# EasyEDA Pro project New Project.eprj

# Schematic Schematic1
Create Date: 2022-03-31; Project Name: New Project; Schematic Name: Schematic1; Update Date: 2022-03-31
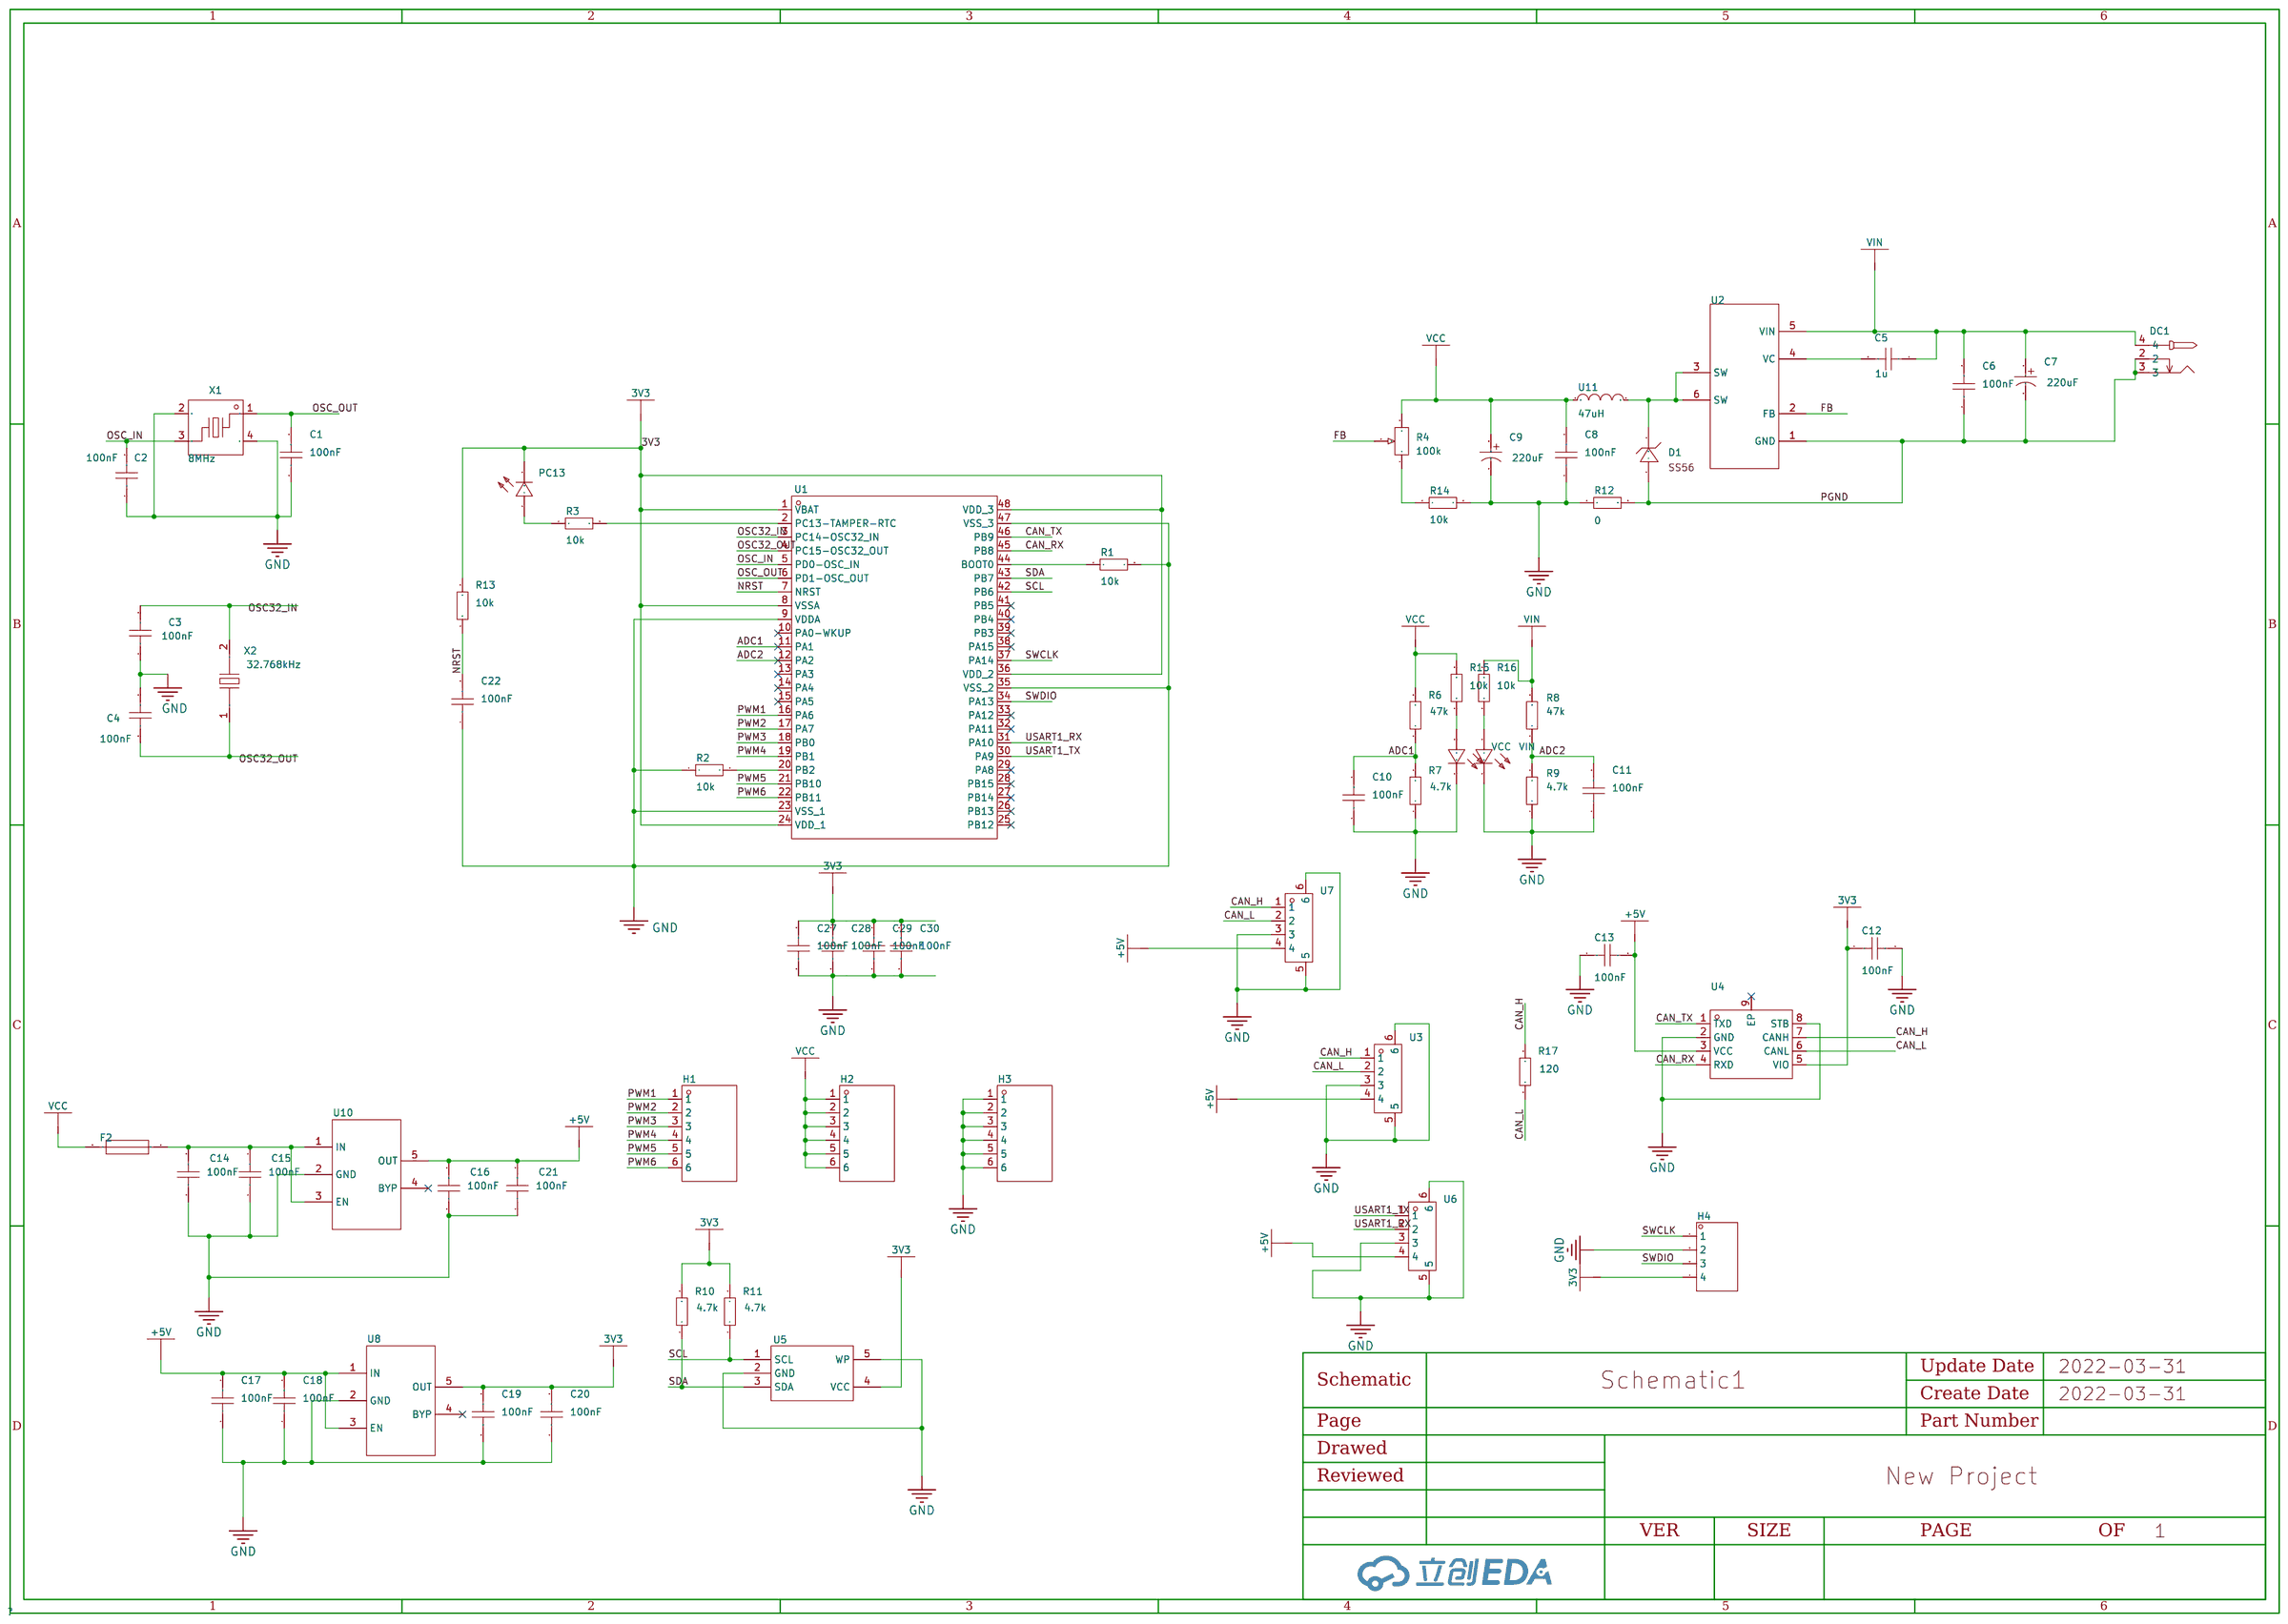
[diagram p0: schematic sheet]

## Parts
C1  100nF  [C0603]
C2  100nF  [C0603]
C3  100nF  [C0603]
C4  100nF  [C0603]
C5  1u  [C0603]
C6  100nF  [C0603]
C7  220uF  [CAP-SMD_BD6.3-L6.6-W6.6-FD-1]
C8  100nF  [C0603]
C9  220uF  [CAP-SMD_BD6.3-L6.6-W6.6-FD-1]
C10  100nF  [C0603]
C11  100nF  [C0603]
C12  100nF  [C0603]
C13  100nF  [C0603]
C14  100nF  [C0603]
C15  100nF  [C0603]
C16  100nF  [C0603]
C17  100nF  [C0603]
C18  100nF  [C0603]
C19  100nF  [C0603]
C20  100nF  [C0603]
C21  100nF  [C0603]
C22  100nF  [C0603]
C27  100nF  [C0603]
C28  100nF  [C0603]
C29  100nF  [C0603]
C30  100nF  [C0603]
D1  -  [SMA_L4.4-W2.6-LS5.0-RD]
DC1  -  [DC-IN-TH_DC-5520-1]
F2  -  [F1206]
H1  -  [HDR-TH_6P-P2.54-V_Z-211-0611-0021-001]
H2  -  [HDR-TH_6P-P2.54-V_Z-211-0611-0021-001]
H3  -  [HDR-TH_6P-P2.54-V_Z-211-0611-0021-001]
H4  -  [HDR-TH_4P-P2.54-V-M]
PC13  -  [LED0603-R-RD]
R1  10k  [R0603_1]
R2  10k  [R0603_1]
R3  10k  [R0603_1]
R4  100k  [RES-ADJ-TH_3P-L9.5-W4.9-P2.50-L_3296W]
R6  47k  [R0603_1]
R7  4.7k  [R0603_1]
R8  47k  [R0603_1]
R9  4.7k  [R0603_1]
R10  4.7k  [R0603]
R11  4.7k  [R0603]
R12  0  [R1206]
R13  10k  [R0603]
R14  10k  [R0603]
R15  10k  [R0603]
R16  10k  [R0603]
R17  120  [R0603]
U1  -  [LQFP-48_L7.0-W7.0-P0.50-LS9.0-BL]
U2  -  [TO-263-5_L10.2-W8.9-P1.70-TL]
U3  -  [CONN-SMD_4P-P2.50_XH2.50-4AB_1]
U4  -  [HVSON-8_L3.0-W3.0-P0.65-BL-EP]
U5  -  [SOT-23-5_L3.0-W1.7-P0.95-LS2.8-BR_1]
U6  -  [CONN-SMD_4P-P2.50_XH2.50-4AB_1]
U7  -  [CONN-SMD_4P-P2.50_XH2.50-4AB_1]
U8  -  [SOT-23-5_L3.0-W1.7-P0.95-LS2.8-TL]
U10  -  [SOT-23-5_L3.0-W1.7-P0.95-LS2.8-BR]
U11  47uH  [IND-TH_L12.5-W6.5-P8.00-D0.5]
VCC  -  [LED0603-R-RD]
VIN  -  [LED0603-R-RD]
X1  8MHz  [CRYSTAL-SMD_4P-L3.2-W2.5-BL]
X2  32.768kHz  [OSC-SMD_2P-L3.2-W1.5-1]

## Library data of the parts
C1-C6 C8 C10-C22 C27-C30 = CC0603KRX7R9BB104: 容值:100nF;精度:±10%;额定电压:50V;温度系数:X7R;; LCSC Part Name: 100nF ±10% 50V; Supplier Part: C14663; Manufacturer: YAGEO(国巨); Supplier Footprint: 0603; JLCPCB Part Class: Basic Part; Datasheet: https://atta.szlcsc.com/upload/public/pdf/source/20170116/1484561234239.pdf; Supplier: LCSC; Tolerance: ±10%; Voltage Rated: 50V; Temperature Coefficient: X7R
C7 C9 = 50SEV10M6.3X5.5: 容值:10uF;精度:±20%;额定电压:50V;电容体直径:6.3mm;电容体长度:5.5mm;纹波电流:-;等效串联电阻:-;工作寿命:2000hrs@85;工作温度:-40~+85;; LCSC Part Name: 10uF ±20% 50V; Supplier Part: C88809; Manufacturer: rubycon(红宝石); Supplier Footprint: SMD,6.3x5.5mm; JLCPCB Part Class: Extended Part; Datasheet: https://atta.szlcsc.com/upload/public/pdf/source/20161125/1480067898590.pdf; Supplier: LCSC; Tolerance: ±20%; Rated Voltage: 50V; φD: 6.3mm; L: 5.5mm; Lifetime @ Temp: 2000hrs@85; Operating Temperature: -40~+85
D1 = SS56_C379835: 直流反向耐压（Vr）:60V;平均整流电流（Io）:5A;正向压降（Vf）:550mV @ 5A;; LCSC Part Name: SS56; Supplier Part: C379835; Manufacturer Part: SS56; Supplier Footprint: SMA; JLCPCB Part Class: Extended Part; Datasheet: https://atta.szlcsc.com/upload/public/pdf/source/20190403/C379835_A6104CE7F1A63165C53675BFBA3A1721.pdf; Supplier: LCSC
DC1 = DC-005 2.0: 连接器类型:DC电源插座;安装方式:弯插;触点内径:2mm;触点外径:6.4mm;额定电流:-;额定电压:-;工作温度范围:-;; LCSC Part Name: DC电源插座 内径:2mm 外径:6.4mm 铁材质; Supplier Part: C16214; Manufacturer: BOOMELE(博穆精密); Supplier Footprint: 插件; JLCPCB Part Class: Extended Part; Datasheet: https://atta.szlcsc.com/upload/public/pdf/source/20190827/C16214_DA59F99E888FED58D9833F5341D610B0.pdf; Supplier: LCSC; Connector Type: DC电源插座; Mounting Style: 弯插; Inside Contact Diameter: 2mm; Outside Contact Diameter: 6.4mm
F2 = JK-nSMD050-30: 最大电压:30V;最大电流:100A;保持电流:500mA;跳闸电流:1A;消耗功率:600mW;初始态阻值(最小值):150m;跳断后阻值(最大值):300m;最大动作时间:100ms;工作温度:-40~+85;; LCSC Part Name: 0.5A 30V 1206 自恢复保险丝 PTC; Supplier Part: C720075; Manufacturer: JK(金科); Supplier Footprint: 1206; JLCPCB Part Class: Extended Part; Datasheet: https://atta.szlcsc.com/upload/public/pdf/source/20200810/C720075_06AF2D4541537091880CC35F0EFB49F8.pdf; Supplier: LCSC; Operating Voltage (Max): 30V; Current Rating (Max): 100A; Hold Current: 500mA; Trip Current: 1A; Power Dissipation: 600mW; Resistance - Initial (Ri) (Min): 150m; Resistance - Post Trip (R1) (Max): 300m; Maximum Time to Trip: 100ms; Operating Temperature: -40~+85
H1-H3 = Z-211-0611-0021-001: 间距:2.54mm;总PIN位数:6;排数:1;插针结构:-;行距:-;安装类型:直插;圆针/方针:-;额定电流:-;额定电压:-;配合针长度:-;塑高:-;触头材质:黄铜;触头镀层:-;颜色:黑色;; LCSC Part Name: 2.54mm; Supplier Part: C190819; Manufacturer: Nextron(台湾正凌); Supplier Footprint: 插件,P=2.54mm; JLCPCB Part Class: Extended Part; Datasheet: https://atta.szlcsc.com/upload/public/pdf/source/20180731/C190819_A681B1380B379CDFC378560BE13D8C8F.pdf; Supplier: LCSC; Pitch: 2.54mm; Number of Pins: 6; Number of Rows: 1; Mounting Type: 直插; Contact Material: 黄铜; Color: 黑色
H4 = B-2100S04P-A110: 间距:2.54mm;总PIN位数:4;排数:1;插针结构:1x4P;行距:-;安装类型:直插;圆针/方针:-;额定电流:-;额定电压:-;配合针长度:6mm;塑高:2.54mm;端接针长度:3mm;触头材质:黄铜;触头镀层:-;工作温度范围:-40~+105;颜色:黑色;; LCSC Part Name: 2.54mm 1x4P; Supplier Part: C124378; Manufacturer: Ckmtw(灿科盟); Supplier Footprint: 插件,P=2.54mm; JLCPCB Part Class: Extended Part; Datasheet: https://atta.szlcsc.com/upload/public/pdf/source/20170821/C124378_1503303307508901532.pdf; Supplier: LCSC; Pitch: 2.54mm; Number of Pins: 4; Number of Rows: 1; Pin Structure: 1x4P; Mounting Type: 直插; Length of Mating Pin: 6mm; Insulation Height: 2.54mm; Length of End Connection Pin: 3mm; Contact Material: 黄铜; Operating Temperature Range: -40~+105; Color: 黑色
PC13 VCC VIN = 19-217/GHC-YR1S2/3T: 发光颜色:翠绿;二极管配置:-;透镜颜色:无色透明;主波长:520nm~535nm;峰值波长:518nm;色温:-;光通量(25时):-;测试电流:20mA;正向电压(VF):3.3V;发光强度:285mcd;功率:110mW;发光角度:120°;安装方式:-;工作温度:-40~+85;; LCSC Part Name: 翠绿LED; Supplier Part: C72043; Manufacturer: EVERLIGHT(台湾亿光); Supplier Footprint: 0603; JLCPCB Part Class: Basic Part; Datasheet: https://atta.szlcsc.com/upload/public/pdf/source/20160507/1462613613780.pdf; Supplier: LCSC; Emitted Color: 翠绿; Lens Color: 无色透明; Dominant Wavelength: 520nm~535nm; Peak Wavelength: 518nm; Forward Current: 20mA; Forward Voltage (VF): 3.3V; Luminous Intensity: 285mcd; Power Dissipation: 110mW; Viewing Angle: 120°; Operating Temperature: -40~+85
R1-R3 R6-R9 = RC-01W1002FT: 阻值:10k;精度:±1%;功率:50mW;温度系数:±200ppm/;最大工作电压:25V;工作温度范围:-55~+125;; LCSC Part Name: 10k ±1%; Supplier Part: C304501; Manufacturer: FH(风华); Supplier Footprint: 0201; JLCPCB Part Class: Extended Part; Datasheet: https://atta.szlcsc.com/upload/public/pdf/source/20181030/C304501_FF38550671994E5E8FB5233A4E4A9820.pdf; Supplier: LCSC; Tolerance: ±1%; Power(Watts): 50mW; Temperature Coefficient: ±200ppm/; Overload Voltage (Max): 25V; Operating Temperature Range: -55~+125
R4 = 3296W-1-104: 阻值:100k;精度:±10%;温度系数:±250ppm/;; LCSC Part Name: 100k ±10%; Supplier Part: C118963; Manufacturer: BOCHEN(博晨); Supplier Footprint: 插件; JLCPCB Part Class: Extended Part; Datasheet: https://atta.szlcsc.com/upload/public/pdf/source/20171114/C118963_15106326662041117450.pdf; Supplier: LCSC; Tolerance: ±10%; Temperature Coefficient: ±250ppm/
R10 R11 R13-R17 = TR0603B10K0P0525Z: 电阻类型:薄膜电阻;阻值:10k;精度:±0.1%;功率:100mW;温度系数:±25ppm/;最大工作电压:75V;工作温度范围:-55~+155;; LCSC Part Name: 10k ±0.1% 100mW; Supplier Part: C188363; Manufacturer: EVER OHMS(天二科技); Supplier Footprint: 0603; JLCPCB Part Class: Extended Part; Datasheet: https://atta.szlcsc.com/upload/public/pdf/source/20190415/C188363_433BF05B6FB8F7A0F5F35A3E4390C55A.pdf; Supplier: LCSC; Type: 薄膜电阻; Tolerance: ±0.1%; Power(Watts): 100mW; Temperature Coefficient: ±25ppm/; Overload Voltage (Max): 75V; Operating Temperature Range: -55~+155
R12 = AC1206FR-7W10KL: 电阻类型:厚膜电阻;阻值:10k;精度:±1%;功率:500mW;温度系数:±100ppm/;最大工作电压:200V;工作温度范围:-55~+155;; LCSC Part Name: 10k ±1% 500mW; Supplier Part: C326700; Manufacturer: YAGEO(国巨); Supplier Footprint: 1206; JLCPCB Part Class: Extended Part; Datasheet: https://atta.szlcsc.com/upload/public/pdf/source/20181101/C326700_C96334D0F3D32995F8E743E70BB73329.pdf; Supplier: LCSC; Type: 厚膜电阻; Tolerance: ±1%; Power(Watts): 500mW; Temperature Coefficient: ±100ppm/; Overload Voltage (Max): 200V; Operating Temperature Range: -55~+155
U1 = STM32F103C8T6: 主频（MAX):72MHz;工作电压:2V ~ 3.6V;; Supplier Part: C8734; Manufacturer: ST(意法半导体); Supplier Footprint: LQFP-48_7x7x05P; JLCPCB Part Class: Basic Part; Datasheet: https://atta.szlcsc.com/upload/public/pdf/source/20140724/1457707174202.pdf; Supplier: LCSC; Speed: 72MHz; Voltage - Supply (Vcc/Vdd): 2V ~ 3.6V; Program Memory Size: 64KB; RAM Size: 20KB; Number of I/O: 37; A/D: 10x12bit; PWM: 13; UART/USART: 3 USART; I2C（SMBUS/PMBUS）: 2; USB Device: 1; CAN: 1
U2 = XL4015E1: 功能类型:降压型;同步整流:-;输出通道数:-;拓扑结构:-;输入电压:-;输出电流(最大值):-;开关频率:-;; LCSC Part Name: 降压型; Supplier Part: C51661; Manufacturer: XLSEMI(芯龙); Supplier Footprint: TO-263-5; JLCPCB Part Class: Extended Part; Datasheet: https://atta.szlcsc.com/upload/public/pdf/source/20150618/1457707323461.pdf; Supplier: LCSC; Function: 降压型
U3 U6 U7 = XH2.5-4P-LS_1: LCSC Part Name: XH2.5-4P-LS; Supplier Part: C9900001834; Manufacturer Part: XH2.5-4P-LS; Supplier Footprint: SMD_XH2.5-4P-LS; JLCPCB Part Class: Extended Part; Datasheet: 2021-11-13/272192A/916e3be17c0c414ab50f4328a8cee917/254立贴承认书.pdf; Supplier: LCSC
U4 = SIT1042TK/3: 类型:-;协议类别:-;驱动器/接收器数:-;数据速率:-;; LCSC Part Name: CAN收发器芯片; Supplier Part: C1121845; Manufacturer: SIT(芯力特); Supplier Footprint: HVSON-8; JLCPCB Part Class: Extended Part; Datasheet: https://atta.szlcsc.com/upload/public/pdf/source/20201217/C1121843_88798D5AA5E17D4FE8882F968B4CCD4F.pdf; Supplier: LCSC
U5 = K24C02_1: 存储器容量:2Kb (256 x 8);存储器接口类型:I2C;工作电压:1.8V ~ 5.5V;; LCSC Part Name: K24C02; Supplier Part: C84964; Manufacturer: 华虹宏力; Manufacturer Part: K24C02; Supplier Footprint: SOT-23-5; JLCPCB Part Class: Extended Part; Datasheet: https://atta.szlcsc.com/upload/public/pdf/source/20161024/1477288693549.pdf; Supplier: LCSC; Memory Format: EEPROM; Memory Size: 2Kb (256 x 8); Memory Interface: I2C; Voltage - Supply: 1.8V ~ 5.5V
U8 = SPX3819M5-L-5-0/TR: 输出类型:固定;输出极性:正;输出通道数:1;最大输入电压:16V;输出电压:5V;压差:700mV@(500mA);输出电流:500mA;电源纹波抑制比(PRSS):-;; LCSC Part Name: Vin=16V Vout=5V 500mA; Supplier Part: C13417; Manufacturer: MaxLinear; Supplier Footprint: SOT-23-5; JLCPCB Part Class: Extended Part; Datasheet: https://atta.szlcsc.com/upload/public/pdf/source/20150720/1457707331934.pdf; Supplier: LCSC; Output Type: 固定; Output Polarity: 正; Number of Outputs: 1; Maximum Input Voltage: 16V; Output Voltage: 5V; Dropout Voltage: 700mV@(500mA); Output Current: 500mA
U10 = SPX3819M5-L-3-3/TR: 输出类型:固定;输出极性:正;输出通道数:1;最大输入电压:16V;输出电压:3.3V;压差:700mV@(500mA);输出电流:500mA;电源纹波抑制比(PRSS):70dB;; LCSC Part Name: Vin=16V Vout=3.3V 500mA 70dB; Supplier Part: C9055; Manufacturer: MaxLinear; Supplier Footprint: SOT-23-5; JLCPCB Part Class: Extended Part; Datasheet: https://atta.szlcsc.com/upload/public/pdf/source/20160421/1461205045150.pdf; Supplier: LCSC; Output Type: 固定; Output Polarity: 正; Number of Outputs: 1; Maximum Input Voltage: 16V; Output Voltage: 3.3V; Dropout Voltage: 700mV@(500mA); Output Current: 500mA; Power Supply Rejection Ratio (PRSS): 70dB
U11 = SLT040125T470MUB: 类型:磁环电感;电感值:47uH;精度:±20%;额定电流:2A;饱和电流(Isat):-;直流电阻(DCR):42m;Q值:-;自谐频率:-;车规等级:-;脚间距:-;; LCSC Part Name: 47uH ±20% 2A 42m; Supplier Part: C326002; Manufacturer: Sunltech(韩国顺磁); Supplier Footprint: 插件; JLCPCB Part Class: Extended Part; Datasheet: https://atta.szlcsc.com/upload/public/pdf/source/20181123/C326002_261DE052296031ED64330EFF6DF1C136.pdf; Supplier: LCSC; Type: 磁环电感; Tolerance: ±20%; Rated Current: 2A; DC Resistance: 42m
X1 = X32258MSB4SI: 晶振类型:贴片无源晶振;频率:8MHz;频率公差:±10ppm;频率稳定度:±30ppm;负载电容:20pF;工作温度:-40~+85;; LCSC Part Name: 8MHz ±10ppm 20pF; Supplier Part: C2682774; Manufacturer: YXC扬兴科技; Supplier Footprint: SMD3225-4P; JLCPCB Part Class: Extended Part; Datasheet: https://atta.szlcsc.com/upload/public/pdf/source/20210106/C2682774_0CD4FDA5D9DA3FBEEC23BD607A48E4B0.pdf; Supplier: LCSC; Crystal Type: 贴片无源晶振; Frequency Tolerance: ±10ppm; Frequency Stability: ±30ppm; Load Capacitance: 20pF; Operating Temperature: -40~+85
X2 = G3100327072070CY: 晶振类型:贴片无源晶振;频率:32.768kHz;频率公差:±20ppm;频率稳定度:-;负载电容:7pF;等效串联电阻(ESR):70k;工作温度:-40~+85;; LCSC Part Name: 32.768kHz ±20ppm 7pF; Supplier Part: C909615; Manufacturer: JGHC(晶光华); Supplier Footprint: SMD3215-2P; JLCPCB Part Class: Extended Part; Datasheet: https://atta.szlcsc.com/upload/public/pdf/source/20201023/C909615_5CB83FDF197FE73AFEAD0F20FB1E7116.pdf; Supplier: LCSC; Crystal Type: 贴片无源晶振; Frequency Tolerance: ±20ppm; Load Capacitance: 7pF; Equivalent Series Resistance (ESR): 70k; Operating Temperature: -40~+85

## Nets
3V3: C12.1 C19.2 C20.2 C27.2 C28.2 C29.2 C30.2 H4.4 PC13.2(C) R10.2 R11.2 R13.2 U1.1(VBAT) U1.8(VSSA) U1.24(VDD_1) U1.36(VDD_2) U1.48(VDD_3) U4.5(VIO) U5.4(VCC) U8.5(OUT)
+5V: C13.2 C16.2 C17.2 C18.2 C21.2 U3.4 U4.3(VCC) U6.4 U7.4 U8.1(IN) U8.3(EN) U10.5(OUT)
GND: C1.1 C2.1 C3.1 C4.1 C8.1 C9.2 C10.1 C11.1 C12.2 C13.1 C14.1 C15.1 C16.1 C17.1 C18.1 C19.1 C20.1 C21.1 C22.1 C27.1 C28.1 C29.1 C30.1 H3.1 H3.2 H3.3 H3.4 H3.5 H3.6 H4.2 R1.2 R2.1 R7.1 R9.1 R12.1 R14.2 U1.9(VDDA) U1.23(VSS_1) U1.35(VSS_2) U1.47(VSS_3) U3.3 U3.5 U3.6 U4.2(GND) U4.8(STB) U5.2(GND) U5.5(WP) U6.3 U6.5 U6.6 U7.3 U7.5 U7.6 U8.2(GND) U10.2(GND) VCC.2(C) VIN.2(C) X1.2(GND) X1.4(GND)
PGND: C6.1 C7.2 D1.2(A) DC1.2 DC1.3 R12.2 U2.1(GND)
VCC: C8.2 C9.1 F2.1 H2.1 H2.2 H2.3 H2.4 H2.5 H2.6 R4.3 R6.2 R15.2 U11.1
VIN: C5.1 C6.2 C7.1 DC1.4 R8.2 R16.2 U2.5(VIN)
ADC1: C10.2 R6.1 R7.2 U1.11(PA1)
ADC2: C11.2 R8.1 R9.2 U1.12(PA2)
CAN_H: R17.2 U3.1 U4.7(CANH) U7.1
CAN_L: R17.1 U3.2 U4.6(CANL) U7.2
CAN_RX: U1.45(PB8) U4.4(RXD)
CAN_TX: U1.46(PB9) U4.1(TXD)
FB: R4.2 U2.2(FB)
NRST: C22.2 R13.1 U1.7(NRST)
OSC32_IN: C3.2 U1.3(PC14-OSC32_IN) X2.2
OSC32_OUT: C4.2 U1.4(PC15-OSC32_OUT) X2.1
OSC_IN: C2.2 U1.5(PD0-OSC_IN) X1.3
OSC_OUT: C1.2 U1.6(PD1-OSC_OUT) X1.1
PWM1: H1.1 U1.16(PA6)
PWM2: H1.2 U1.17(PA7)
PWM3: H1.3 U1.18(PB0)
PWM4: H1.4 U1.19(PB1)
PWM5: H1.5 U1.21(PB10)
PWM6: H1.6 U1.22(PB11)
SCL: R11.1 U1.42(PB6) U5.1(SCL)
SDA: R10.1 U1.43(PB7) U5.3(SDA)
SWCLK: H4.1 U1.37(PA14)
SWDIO: H4.3 U1.34(PA13)
USART1_RX: U1.31(PA10) U6.2
USART1_TX: U1.30(PA9) U6.1
$1N3592: R1.1 U1.44(BOOT0)
$1N3832: R2.2 U1.20(PB2)
$1N4516: R3.2 U1.2(PC13-TAMPER-RTC)
$1N4646: PC13.1(A) R3.1
$1N6342: D1.1(C) U2.3(SW) U2.6(SW) U11.2
$1N8410: R4.1 R14.1
$1N9123: C5.2 U2.4(VC)
$1N37223: C14.2 C15.2 F2.2 U10.1(IN) U10.3(EN)
$1N44323: R15.1 VCC.1(A)
$1N44406: R16.1 VIN.1(A)

Not connected (* = marked no-connect by the designer): U1 10(PA0-WKUP)* 13(PA3)* 14(PA4)* 15(PA5)* 25(PB12)* 26(PB13)* 27(PB14)* 28(PB15)* 29(PA8)* 32(PA11)* 33(PA12)* 38(PA15)* 39(PB3)* 40(PB4)* 41(PB5)*; U4 9(EP)*; U8 4(BYP)*; U10 4(BYP)*

# Board PCB1
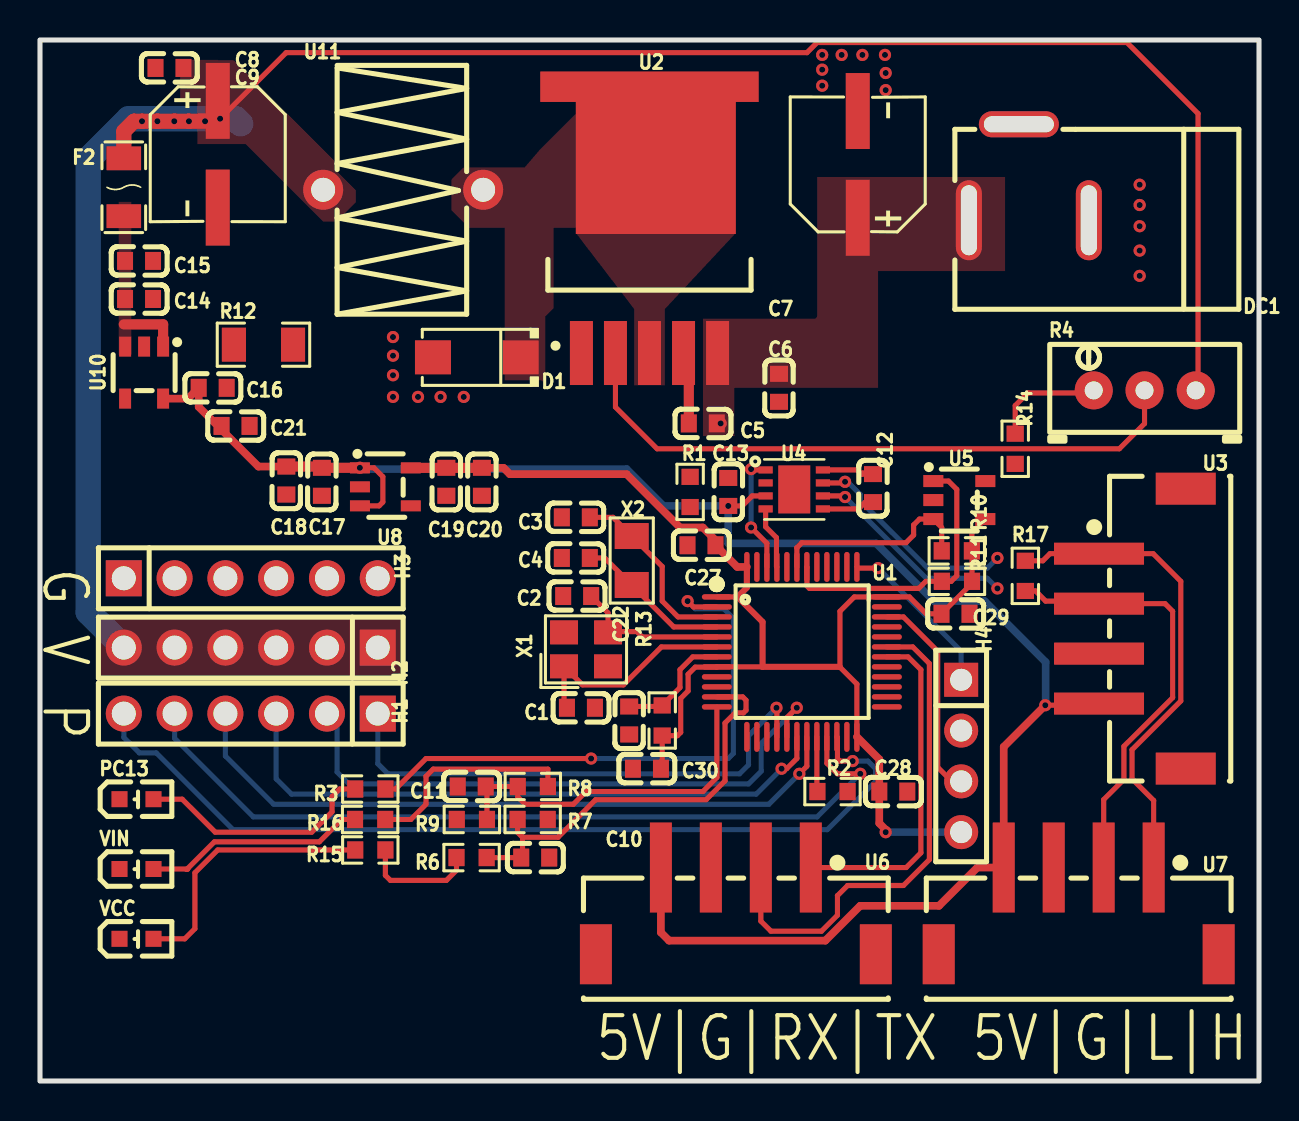
[diagram p1: board, top side]
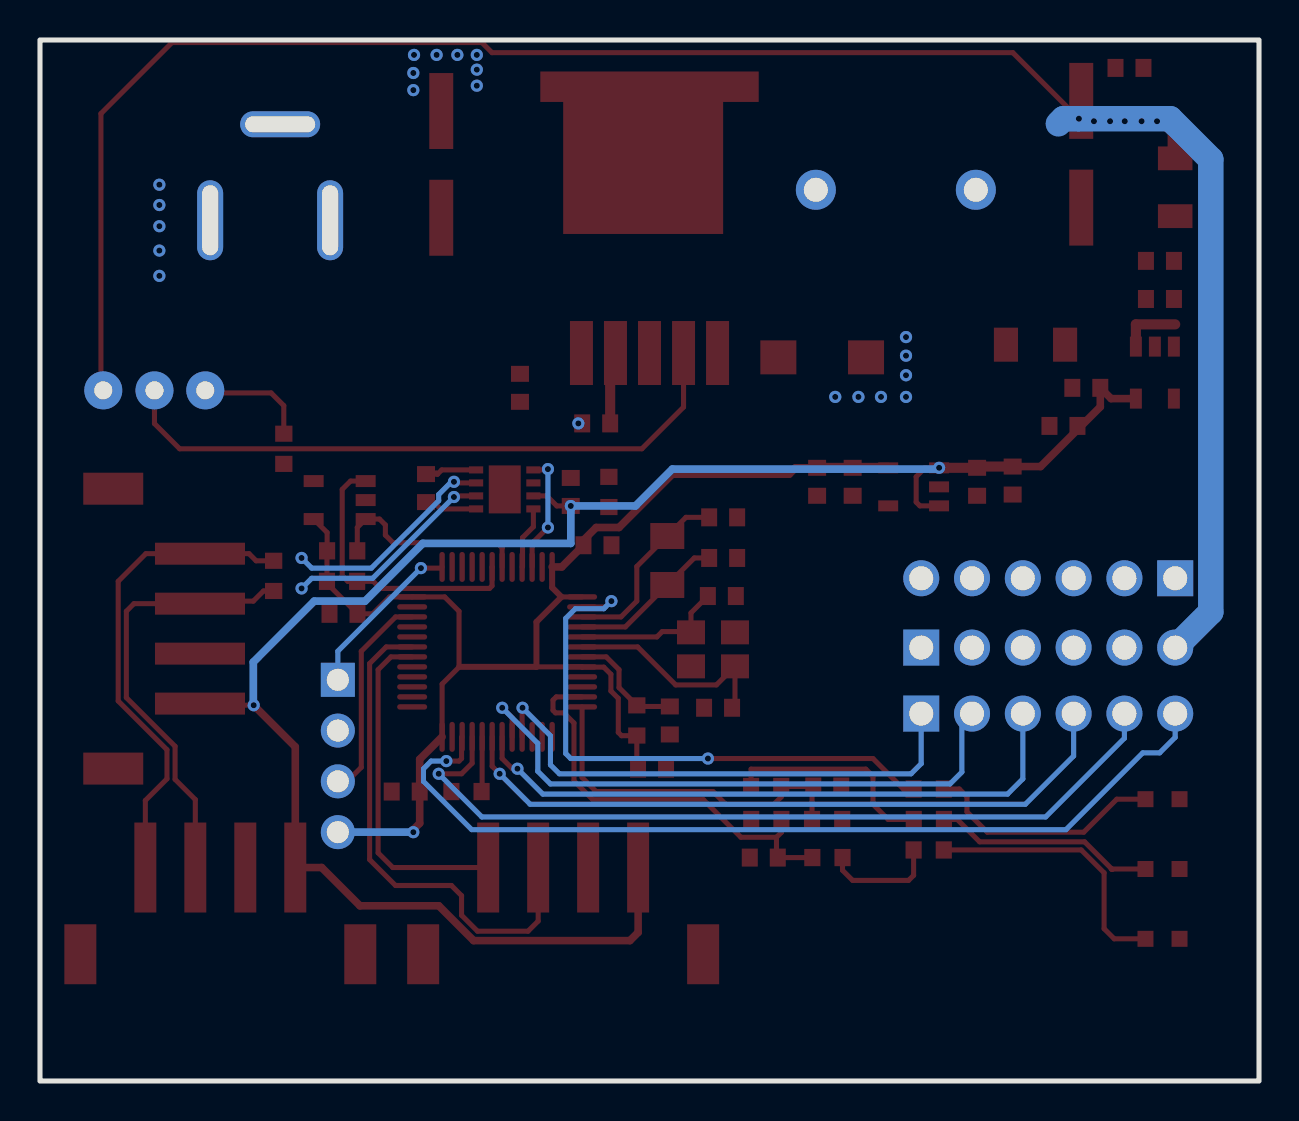
[diagram p2: board, bottom side, seen from below]

Outline 60.96 x 52.07 mm; copper layers: Top Layer, Bottom Layer. Coordinates in mm from the lower left corner of the outline.
Outline path: rectangle 0,52.07 60.96,0
Stack: Top Layer 0.035mm / 介电1 1.51mm FR4 er 4.5 / Bottom Layer 0.035mm

## Design rules (mm)
spacing safeClearance (default): track to track 0.152, other pairs 0.152 to 0.3
track width trackWidth (default): min 0.127, default 0.254, max 2.54
track width 5V: min 0.381, default 0.508, max 2.54
differential pair differentialPair (default): width min 0.127, default 0.254, max 2.54; gap min 0.152, default 0.152
via viaSize (default): diameter min 0.5, default 0.61, max 10; hole min 0.3, default 0.305, max 6

## Placement (name value [footprint] x y rotation side)
C1  100nF  [C0603]  27.05 18.67 180 top
C2  100nF  [C0603]  26.86 24.26 0 top
C3  100nF  [C0603]  26.8 28.19 0 top
C4  100nF  [C0603]  26.8 26.16 0 top
C5  1u  [C0603]  33.15 32.89 180 top
C6  100nF  [C0603]  36.96 34.67 90 top
C7  220uF  [CAP-SMD_BD6.3-L6.6-W6.6-FD-1]  40.89 45.85 90 top
C8  100nF  [C0603]  6.48 50.67 0 top
C9  220uF  [CAP-SMD_BD6.3-L6.6-W6.6-FD-1]  8.89 46.35 270 top
C10  100nF  [C0603]  24.76 11.18 180 top
C11  100nF  [C0603]  21.59 14.73 0 top
C12  100nF  [C0603]  41.66 29.66 90 top
C13  100nF  [C0603]  34.42 29.46 270 top
C14  100nF  [C0603]  4.95 39.12 180 top
C15  100nF  [C0603]  4.95 41.02 180 top
C16  100nF  [C0603]  8.64 34.67 180 top
C17  100nF  [C0603]  14.1 29.97 90 top
C18  100nF  [C0603]  12.32 30.03 90 top
C19  100nF  [C0603]  20.32 29.97 90 top
C20  100nF  [C0603]  22.1 29.97 90 top
C21  100nF  [C0603]  9.78 32.77 180 top
C22  100nF  [C0603]  29.46 18.03 90 top
C27  100nF  [C0603]  33.08 26.8 0 top
C28  100nF  [C0603]  42.67 14.48 180 top
C29  100nF  [C0603]  45.78 23.37 180 top
C30  100nF  [C0603]  30.35 15.62 0 top
D1  -  [SMA_L4.4-W2.6-LS5.0-RD]  21.84 36.19 180 top
DC1  -  [DC-IN-TH_DC-5520-1]  49.45 45.45 180 top
F2  -  [F1206]  4.19 44.7 270 top
H1  -  [HDR-TH_6P-P2.54-V_Z-211-0611-0021-001]  10.54 18.38 180 top
H2  -  [HDR-TH_6P-P2.54-V_Z-211-0611-0021-001]  10.54 21.68 180 top
H3  -  [HDR-TH_6P-P2.54-V_Z-211-0611-0021-001]  10.54 25.15 0 top
H4  -  [HDR-TH_4P-P2.54-V-M]  46.07 16.26 270 top
PC13  -  [LED0603-R-RD]  4.83 14.1 0 top
R1  10k  [R0603_1]  32.51 29.46 90 top
R2  10k  [R0603_1]  39.63 14.48 180 top
R3  10k  [R0603_1]  16.52 14.6 0 top
R4  100k  [RES-ADJ-TH_3P-L9.5-W4.9-P2.50-L_3296W]  55.25 34.54 0 top
R6  47k  [R0603_1]  21.58 11.18 180 top
R7  4.7k  [R0603_1]  24.64 13.08 180 top
R8  47k  [R0603_1]  24.65 14.73 0 top
R9  4.7k  [R0603_1]  21.6 13.08 0 top
R10  4.7k  [R0603]  45.85 26.52 0 top
R11  4.7k  [R0603]  45.85 24.99 0 top
R12  0  [R1206]  11.18 36.83 0 top
R13  10k  [R0603]  31.11 18.03 270 top
R14  10k  [R0603]  48.77 31.62 270 top
R15  10k  [R0603]  16.52 11.56 0 top
R16  10k  [R0603]  16.51 13.08 0 top
R17  120  [R0603]  49.28 25.27 90 top
U1  -  [LQFP-48_L7.0-W7.0-P0.50-LS9.0-BL]  38.1 21.46 270 top
U2  -  [TO-263-5_L10.2-W8.9-P1.70-TL]  30.48 41.42 90 top
U3  -  [CONN-SMD_4P-P2.50_XH2.50-4AB_1]  55.13 22.63 270 top
U4  -  [HVSON-8_L3.0-W3.0-P0.65-BL-EP]  37.72 29.59 270 top
U5  -  [SOT-23-5_L3.0-W1.7-P0.95-LS2.8-BR_1]  45.97 29.06 180 top
U6  -  [CONN-SMD_4P-P2.50_XH2.50-4AB_1]  34.8 8.51 180 top
U7  -  [CONN-SMD_4P-P2.50_XH2.50-4AB_1]  51.94 8.51 180 top
U8  -  [SOT-23-5_L3.0-W1.7-P0.95-LS2.8-TL]  17.27 29.72 0 top
U10  -  [SOT-23-5_L3.0-W1.7-P0.95-LS2.8-BR]  5.21 35.43 90 top
U11  47uH  [IND-TH_L12.5-W6.5-P8.00-D0.5]  18.16 44.58 0 top
VCC  -  [LED0603-R-RD]  4.83 7.11 0 top
VIN  -  [LED0603-R-RD]  4.83 10.6 0 top
X1  8MHz  [CRYSTAL-SMD_4P-L3.2-W2.5-BL]  27.31 21.59 0 top
X2  32.768kHz  [OSC-SMD_2P-L3.2-W1.5-1]  29.59 26.03 90 top

## Footprints (pads in the part's own frame, mm; a bottom-side part is the same pattern mirrored in y, then rotated)
C0603
  rect 0.8x0.9 smd: 1(-0.7,0) 2(0.7,0)
CAP-SMD_BD6.3-L6.6-W6.6-FD-1
  rect 3.8x1.199 smd: 1(-2.67,0) 2(2.67,0)
CONN-SMD_4P-P2.50_XH2.50-4AB_1
  rect 1.1x4.501 smd: 1(-3.749,-2.169) 2(-1.25,-2.169) 3(1.25,-2.169) 4(3.749,-2.169)
  rect 1.6x2.999 smd: 5(-7,2.169) 6(7,2.169)
CRYSTAL-SMD_4P-L3.2-W2.5-BL
  rect 1.4x1.2 smd: 1(-1.1,-0.85) 2(1.1,-0.85) 3(1.1,0.85) 4(-1.1,0.85)
DC-IN-TH_DC-5520-1
  oval 4x1.3 hole 3.5x0.8: 2(0.5,-2.401)
  oval 1.3x4 hole 0.8x3.5: 3(-2.999,2.401) 4(2.999,2.401)
F1206
  rect 1.192x1.727 smd: 1(-1.446,0) 2(1.446,0)
HDR-TH_4P-P2.54-V-M
  rect 1.7x1.7 hole 1.1: 1(-3.81,0)
  round 1.7 hole 1.1: 2(-1.27,0) 3(1.27,0) 4(3.81,0)
HDR-TH_6P-P2.54-V_Z-211-0611-0021-001
  rect 1.801x1.801 hole 1.199: 1(-6.35,0)
  round 1.801 hole 1.199: 2(-3.81,0) 3(-1.27,0) 4(1.27,0) 5(3.81,0) 6(6.35,0)
HVSON-8_L3.0-W3.0-P0.65-BL-EP
  rect 0.355x0.711 smd: 1(-0.976,-1.433) 2(-0.325,-1.433) 3(0.325,-1.433) 4(0.976,-1.433) 5(0.976,1.433) 6(0.325,1.433) 7(-0.325,1.433) 8(-0.976,1.433)
  rect 2.401x1.6 smd: 9(0,0)
IND-TH_L12.5-W6.5-P8.00-D0.5
  round 1.999 hole 1.199: 1(-4,0) 2(4,0)
LED0603-R-RD
  rect 0.8x0.8 smd: 1(0.851,0) 2(-0.851,0)
LQFP-48_L7.0-W7.0-P0.50-LS9.0-BL
  oval 0.269x1.501 smd: 1(-2.751,-4.25) 2(-2.251,-4.25) 3(-1.75,-4.25) 4(-1.25,-4.25) 5(-0.75,-4.25) 6(-0.249,-4.25) 7(0.249,-4.25) 8(0.75,-4.25) 9(1.25,-4.25) 10(1.75,-4.25) 11(2.251,-4.25) 12(2.751,-4.25) 25(2.751,4.25) 26(2.251,4.25) 27(1.75,4.25) 28(1.25,4.25) 29(0.75,4.25) 30(0.249,4.25) 31(-0.249,4.25) 32(-0.75,4.25) 33(-1.25,4.25) 34(-1.75,4.25) 35(-2.251,4.25) 36(-2.751,4.25)
  oval 1.501x0.269 smd: 13(4.25,-2.751) 14(4.25,-2.251) 15(4.25,-1.75) 16(4.25,-1.25) 17(4.25,-0.75) 18(4.25,-0.249) 19(4.25,0.249) 20(4.25,0.75) 21(4.25,1.25) 22(4.25,1.75) 23(4.25,2.251) 24(4.25,2.751) 37(-4.25,2.751) 38(-4.25,2.251) 39(-4.25,1.75) 40(-4.25,1.25) 41(-4.25,0.75) 42(-4.25,0.249) 43(-4.25,-0.249) 44(-4.25,-0.75) 45(-4.25,-1.25) 46(-4.25,-1.75) 47(-4.25,-2.251) 48(-4.25,-2.751)
OSC-SMD_2P-L3.2-W1.5-1
  rect 1.3x1.7 smd: 1(-1.224,0) 2(1.224,0)
R0603
  rect 0.807x0.864 smd: 1(-0.754,0) 2(0.754,0)
R0603_1
  rect 0.807x0.864 smd: 1(-0.754,0) 2(0.754,0)
R1206
  rect 1.206x1.702 smd: 1(-1.478,0) 2(1.478,0)
RES-ADJ-TH_3P-L9.5-W4.9-P2.50-L_3296W
  round 1.9 hole 0.899: 1(-2.55,0) 2(-0.01,0) 3(2.55,0)
SMA_L4.4-W2.6-LS5.0-RD
  rect 1.801x1.7 smd: 1(-2.192,0) 2(2.192,0)
SOT-23-5_L3.0-W1.7-P0.95-LS2.8-BR
  rect 1.001x0.6 smd: 1(1.3,-0.95) 2(1.3,0) 3(1.3,0.95) 4(-1.3,0.95) 5(-1.3,-0.95)
SOT-23-5_L3.0-W1.7-P0.95-LS2.8-BR_1
  rect 1.001x0.6 smd: 1(1.3,-0.95) 2(1.3,0) 3(1.3,0.95) 4(-1.3,0.95) 5(-1.3,-0.95)
SOT-23-5_L3.0-W1.7-P0.95-LS2.8-TL
  rect 1x0.55 smd: 1(-1.272,0.95) 2(-1.272,0) 3(-1.272,-0.95) 4(1.272,-0.95) 5(1.272,0.95)
TO-263-5_L10.2-W8.9-P1.70-TL
  rect 3.2x1.151 smd: 1(-5.009,3.404) 2(-5.009,1.702) 3(-5.009,0) 4(-5.009,-1.702) 5(-5.009,-3.404)
  custom 8.128x10.922 smd: 6(5.009,-0.318)

## Nets
As in the schematic.

Pads without a net: U1 10 13 14 15 25 26 27 28 29 32 33 38 39 40 41; U4 9; U8 4; U10 4

## Via types
v1: diameter 0.61, hole 0.305, Top Layer to Bottom Layer, 46 vias

## Routing (per net, layer and track width the routed paths; a pad name or vN(x,y) marks a point on that pad's centre or on a via; arc(x,y) is an arc through that point)
3V3: length 69.1
  Top Layer w0.254: 46.61,24.89 R11.2 ; 46.61,24.89 46.61,26.51 R10.2 46.6,27.43 U5.4 ; 46.61,24.89 C29.2 44.32,23.37 43.48,24.21 U1.36 40.72,24.21 40,23.49 40,20.73 39.99,20.71 40.85,19.85 U1.24 ; U1.1 34.88,24.21 ; U4.5 40.93,28.62 41.28,28.96 C12.1 ; 36.13,20.71 U1.8 33.84,20.7 32.77,20.7 32.41,20.35 32.41,19.51 32.04,19.14 32.04,17.44 31.88,17.27 31.12,17.27 R13.2 31.11,15.68 C30.2
  Top Layer w0.3: 39.99,20.71 36.13,20.71 36.13,22.96 34.88,24.21 35.35,24.68 U1.48
  Top Layer w0.381: 22.1,30.67 23.18,30.67 23.5,30.35 29.34,30.35 32,27.69 33.15,27.69 33.78,27.05 C27.2 34.87,25.71 U1.48 ; U1.24 41.97,16.09 C28.2 41.97,12.89 42.29,12.57 v1(42.29,12.45)
  Top Layer w0.508: U8.5 22.09,30.67 22.1,30.67
  Bottom Layer w0.381: v1(42.29,12.45) 42.29,12.45 H4.4
+5V: length 93.5
  Top Layer w0.254: v1(50.27,18.8) 52.88,18.8 U3.4 ; U8.1 16.7,30.67 17.14,30.23 17.14,28.96 16.96,28.77 U8.3 ; v1(34.42,28.76) 35.11,28.76 35.62,29.27 U4.3
  Top Layer w0.381: U10.5 7.4,34.13 C16.2 7.94,33.72 10.92,30.73 C18.2 ; v1(50.27,18.8) 48.19,16.72 U7.4 46.87,10.68 44.96,8.76 41.02,8.76 39.28,7.02 31.46,7.02 31.05,7.43 U6.4
  Top Layer w0.508: C18.2 14.03,30.73 14.1,30.67 v1(16,30.67) U8.1
  Bottom Layer w0.381: 50.29,18.8 50.29,20.95 47.24,24 44.7,24 41.82,26.89 34.42,26.89 v1(34.42,28.76) 31.18,28.76 29.34,30.61 16,30.61
GND: length 2.7
  Top Layer w0.254: 41.08,30.35 40.87,30.57 U4.8 ; 41.08,30.35 41.65,30.35 C12.2 ; 41.08,30.35 41.15,30.42
PGND:
  vias: v1(17.65,37.21) v1(17.65,36.28) v1(17.65,35.3) v1(17.65,34.22) v1(18.9,34.22) v1(20.03,34.22) v1(21.19,34.22) v1(39.12,51.32) v1(39.12,50.59) v1(39.12,49.78) v1(40.09,51.32) v1(41.13,51.32) v1(42.26,51.32) v1(42.29,50.42) v1(42.29,49.56) v1(54.99,44.83) v1(54.99,43.81) v1(54.99,42.76) v1(54.99,41.54) v1(54.99,40.27)
VCC: length 111
  Top Layer w0.254: 20.83,11.18 20.83,10.54 20.32,10.03 17.53,10.03 17.27,10.29 R15.2 ; R4.3 57.91,34.66 57.91,48.39 54.36,51.94 38.86,51.94 38.35,51.43 12.31,51.43 v1(9.01,48.13)
  Top Layer w0.762: v1(8.25,48.01) v1(7.45,48.01) v1(6.71,48.01) v1(5.87,48.01) v1(5.1,48.01) 4.7,48.01 4.19,47.5 F2.1
  Bottom Layer w1.27: 10.03,47.88 9.78,48.13 v1(9.01,48.13) 4.44,48.13 2.41,46.1 2.41,23.46 H2.6
VIN: length 10.9
  Top Layer w0.254: R8.2 25.4,15.6 19.66,15.6 19.3,15.24 19.3,13.84 18.54,13.08 R16.2
  vias: v1(34.04,32.89)
ADC1: length 21.3
  Top Layer w0.254: 24.13,12.19 24.13,11.24 C10.2 R6.1 ; 24.13,12.19 23.88,12.45 23.88,12.45 R7.2 ; 24.13,12.19 25.91,12.19 27.79,14.07 33.32,14.07 34.26,15.01 34.26,17.91 34.76,18.41 35.18,18.41 35.31,18.54 35.31,19.05 35.14,19.21 U1.11
ADC2: length 18
  Top Layer w0.254: R9.2 22.35,14.67 C11.2 R8.1 23.89,14.21 24.26,13.84 26.67,13.84 27.31,14.48 33.15,14.48 33.85,15.18 U1.12
CAN_H: length 35.2
  Top Layer w0.254: 55.69,10.68 55.69,14.03 54.61,15.11 54.61,16.57 57.05,19.01 57.05,24.99 55.67,26.38 U3.1 50.51,26.38 50.15,26.02 R17.2 ; 39.15,29.92 40.2,29.92 v1(40.26,29.97)
  Bottom Layer w0.254: v1(40.26,29.97) 40.39,29.97 41.02,29.34 41.02,29.02 44.39,25.65 47.37,25.65 v1(47.88,26.16)
CAN_L: length 32.7
  Top Layer w0.254: U7.2 53.19,14.08 54.2,15.09 54.2,16.74 56.64,19.18 56.64,23.49 56.26,23.88 U3.2 52.83,24 50.29,24 49.78,24.51 R17.1 ; v1(40.26,29.21) 40.2,29.27 U4.6
  Bottom Layer w0.254: v1(40.26,29.21) 44.32,25.15 47.37,25.15 v1(47.88,24.64)
CAN_RX: length 3.1
  Top Layer w0.254: U1.45 36.83,25.73 36.83,27.18 36.29,27.72 U4.4
CAN_TX: length 6
  Top Layer w0.254: U4.1 35.6,30.57 v1(35.56,30.61) ; v1(35.56,27.69) 36.35,26.9 U1.46
  Bottom Layer w0.254: v1(35.56,30.61) v1(35.56,27.69)
FB: length 32.2
  Top Layer w0.254: R4.2 55.23,32.88 53.97,31.62 30.86,31.62 28.78,33.71 U2.2
NRST: length 5.9
  Top Layer w0.254: U1.7 32.64,21.21 32,20.57 32,19.68 R13.1 31.06,18.73 C22.2
OSC32_IN: length 9.4
  Top Layer w0.254: C3.2 28.66,28.19 X2.2 31.11,25.74 31.11,24 31.91,23.21 U1.3
OSC32_OUT: length 7.8
  Top Layer w0.254: U1.4 31.69,22.71 X2.1 28.24,26.16 C4.2
OSC_IN: length 7.7
  Top Layer w0.254: U1.5 30.11,22.21 29.84,22.48 28.44,22.48 X1.3 28.41,23.41 C2.2
OSC_OUT: length 10.9
  Top Layer w0.254: U1.6 31.07,21.71 29.17,19.81 27.13,19.81 X1.1 26.2,18.81 C1.2
PWM1: length 26.3
  Top Layer w0.254: v1(36.83,18.67) 36.85,18.65 U1.16
  Bottom Layer w0.254: v1(36.83,18.67) 35.43,17.27 35.43,15.81 34.99,15.37 17.4,15.37 16.89,15.87 H1.1
PWM2: length 30.4
  Top Layer w0.254: U1.17 37.35,18.17 v1(37.85,18.67)
  Bottom Layer w0.254: v1(37.85,18.67) 36.07,16.89 36.07,15.49 35.43,14.86 15.45,14.86 14.86,15.45 14.86,17.87 H1.2
PWM3: length 31.4
  Top Layer w0.254: v1(37.08,15.62) 37.34,15.62 37.85,16.13 U1.18
  Bottom Layer w0.254: H1.3 11.81,15.11 12.57,14.35 35.81,14.35 v1(37.08,15.62)
PWM4: length 34.5
  Top Layer w0.254: U1.19 38.35,15.74 v1(37.97,15.37)
  Bottom Layer w0.254: v1(37.97,15.37) 36.45,13.84 11.68,13.84 9.27,16.26 H1.4
PWM5: length 41.3
  Top Layer w0.254: U1.21 39.35,15.9 39.88,15.37 v1(41.02,15.37)
  Bottom Layer w0.254: H1.5 6.73,17.14 10.67,13.21 38.86,13.21 v1(41.02,15.37)
PWM6: length 45.5
  Top Layer w0.254: v1(40.64,16) 40,16 39.88,16.13 39.88,17.19 U1.22
  Bottom Layer w0.254: v1(40.64,16) 41.4,16 41.78,15.62 41.78,14.99 39.37,12.57 9.65,12.57 5.81,16.41 4.97,16.41 4.19,17.19 H1.6
SCL: length 14.4
  Top Layer w0.254: U1.42 38.35,25.71 38.35,24.76 38.48,24.64 43.94,24.64 44.3,24.99 R11.1 45.57,24.99 45.85,25.27 45.85,29.59 45.43,30.01 U5.1
SDA: length 10.4
  Top Layer w0.254: R10.1 45.09,27.69 U5.3 43.98,28.11 43.69,27.81 43.69,27.3 43.31,26.92 38.1,26.92 37.85,26.67 37.85,26.66 U1.43
SWCLK: length 8.4
  Top Layer w0.254: U1.37 40.91,25.65 v1(41.91,25.65)
  Bottom Layer w0.254: v1(41.91,25.65) 46.07,21.5 H4.1
SWDIO: length 10.5
  Top Layer w0.254: 46.05,14.95 45.63,14.95 44.89,15.69 44.89,21.5 43.18,23.21 U1.34
USART1_RX: length 25.7
  Top Layer w0.254: U1.31 43.65,21.71 44.48,20.88 44.48,11.08 43.18,9.78 40.39,9.78 39.88,9.27 39.88,8.29 39.08,7.49 36.55,7.49 36.05,8 U6.2
USART1_TX: length 16.9
  Top Layer w0.254: U6.1 43.32,10.68 44.05,11.41 44.05,20.57 43.41,21.21 U1.30
$1N3832: length 2.7
  Top Layer w0.254: U1.20 38.85,14.51 R2.2
$1N4516: length 29.1
  Top Layer w0.254: R3.2 17.78,14.6 19.3,16.13 v1(27.56,16.13) ; U1.2 32.67,23.71 v1(32.38,24)
  Bottom Layer w0.254: v1(32.38,24) 32.77,23.62 34.19,23.62 34.67,23.14 34.67,16.38 34.42,16.13 v1(27.56,16.13)
$1N4646: length 12.1
  Top Layer w0.254: R3.1 14.99,14.6 14.6,14.22 14.6,13.46 13.59,12.45 8.76,12.45 7.11,14.1 PC13.1
$1N8410: length 5.6
  Top Layer w0.254: R14.1 48.77,33.78 49.4,34.42 52.57,34.42 R4.1
$1N9123: length 3.6
  Top Layer w0.508: C5.2 32.45,36.15 U2.4
$1N37223: length 3.1
  Top Layer w0.508: 4.19,37.85 6.16,37.85 U10.1
$1N44323: length 13.6
  Top Layer w0.254: R15.1 8.89,11.56 7.75,10.41 7.75,7.62 7.24,7.11 VCC.1
$1N44406: length 11.2
  Top Layer w0.254: 7.36,10.6 7.34,10.58 7.39,10.6 7.36,10.6 ; 7.36,10.6 8.72,11.96 13.97,11.96 15.09,13.08 R16.1 ; 7.36,10.6 VIN.1

## Copper pours and planes (outline as drawn; the poured copper is in the pictures)
GND on Top Layer: 0,52.07 11.21,52.07 11.21,31.45 11.18,31.42 60.88,31.42 60.96,31.34 60.96,0 0.05,0 0,0.05
GND on Bottom Layer: 0,52.07 11.21,52.07 11.21,31.45 11.18,31.42 60.88,31.42 60.96,31.34 60.96,0 0.05,0 0,0.05
PGND on Top Layer: 11.83,52.29 60.45,52.29 60.45,32.13 11.83,32.13
PGND on Bottom Layer: 11.83,52.16 60.45,52.16 60.45,32 11.83,32
VCC on Top Layer: 2.92,23.2 18.16,23.2 18.16,20.15 2.92,20.15
VCC on Top Layer: 7.87,51.05 15.79,51.05 15.79,42.99 7.87,42.99
VCC on Top Layer: 7.01,51.08 8.89,51.08 8.89,49.02 7.01,49.02
VIN on Top Layer: 33.15,45.21 48.26,45.21 48.26,32.26 33.15,32.26
$1N6342 on Top Layer: 26.8,42.42 34.8,42.42 34.8,34.8 26.8,34.8
$1N6342 on Top Layer: 23.24,42.94 25.69,42.94 25.69,34.98 23.24,34.98
$1N6342 on Top Layer: 20.57,48.39 30.8,48.39 30.8,42.67 20.57,42.67
$1N37223 on Top Layer: 3.94,43.97 4.57,43.97 4.57,36.32 3.94,36.32

## Text on the board
Top Silkscreen Layer: G | V | P | 5V|G|RX|TX | 5V|G|L|H
